# Altium schematic sheet 原理图.SchDoc
size A4
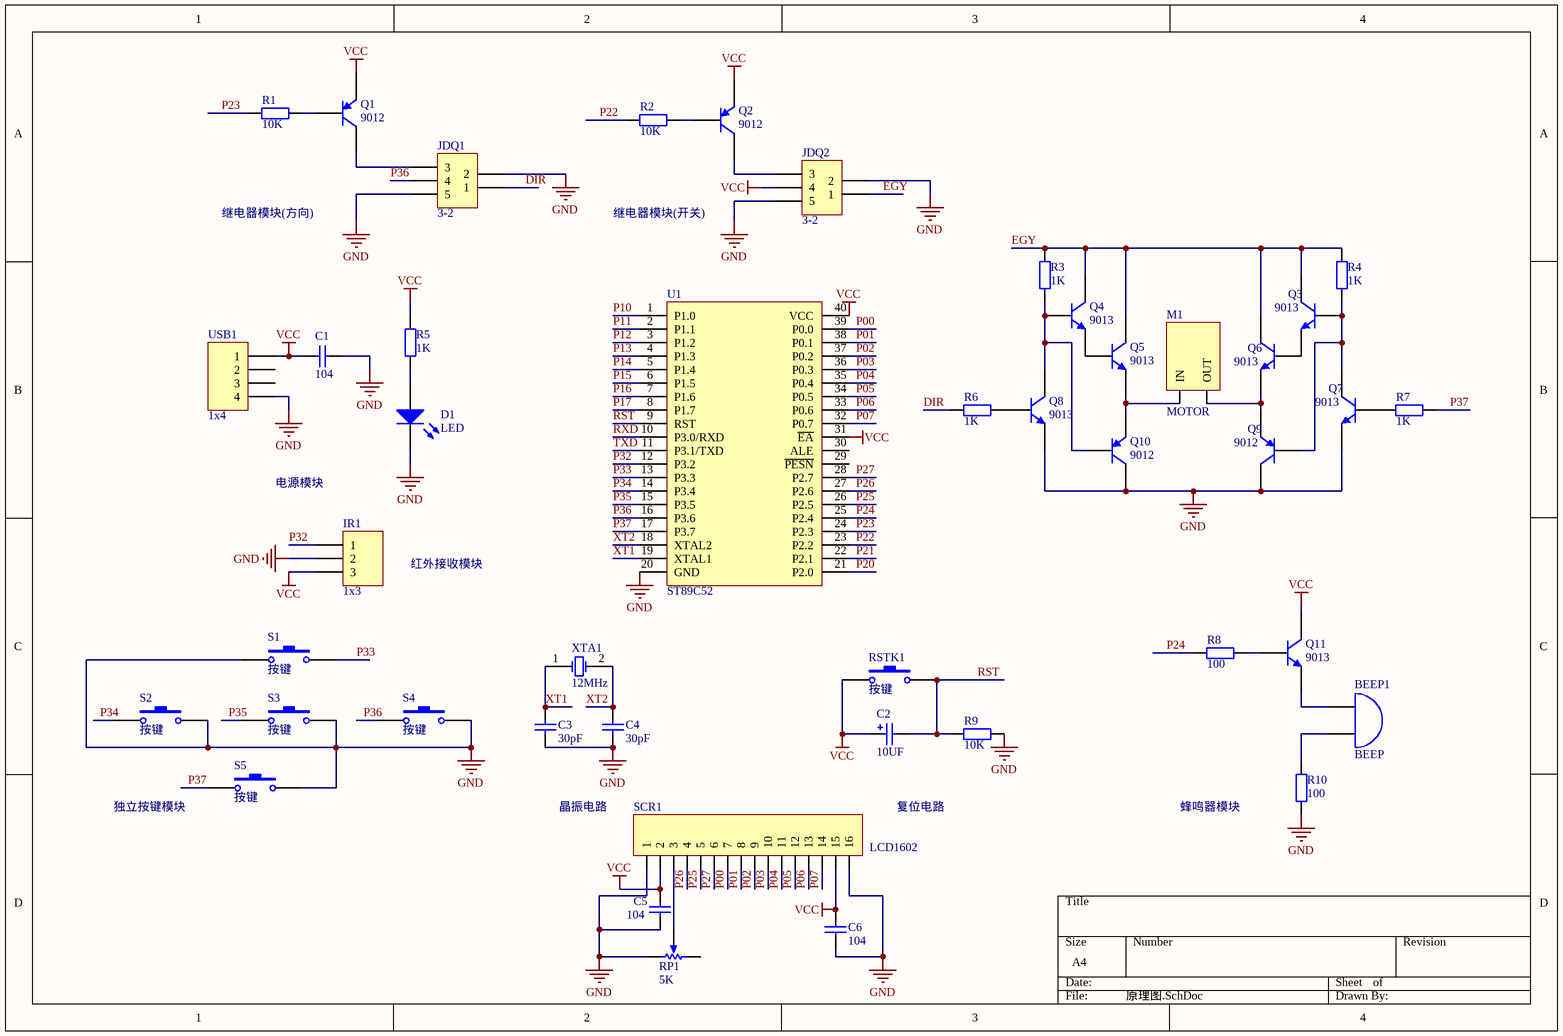
[diagram p0: 原理图.SchDoc]

## Parts
BEEP1  BEEP  [BEEP]
C1  104  [CAP]
C2  10UF  [CAP-ELEC]
C3  30pF  [CAP]
C4  30pF  [CAP]
C5  104  [CAP]
C6  104  [CAP]
D1  LED  [LED]
IR1  1x3  [RAY]
JDQ1  3-2  [RELAY]
JDQ2  3-2  [RELAY]
M1  MOTOR  [MOTOR]
Q1  9012  [PINS-3]
Q2  9012  [PINS-3]
Q3  9013  [PINS-3]
Q4  9013  [PINS-3]
Q5  9013  [PINS-3]
Q6  9013  [PINS-3]
Q7  9013  [PINS-3]
Q8  9013  [PINS-3]
Q9  9012  [PINS-3]
Q10  9012  [PINS-3]
Q11  9013  [PINS-3]
R1  10K  [RES]
R2  10K  [RES]
R3  1K  [RES]
R4  1K  [RES]
R5  1K  [RES]
R6  1K  [RES]
R7  1K  [RES]
R8  100  [RES]
R9  10K  [RES]
R10  100  [RES]
RP1  5K  [RES-ADJ]
RSTK1  按键  [KEY-4]
S1  按键  [KEY-4]
S2  按键  [KEY-4]
S3  按键  [KEY-4]
S4  按键  [KEY-4]
S5  按键  [KEY-4]
SCR1  LCD1602  [LCD]
U1  ST89C52  [STC89C52]
USB1  1x4  [USB]
XTA1  12MHz  [CRYSTAL]

## Nets
GND: C1.1 C3.1 C4.1 C5.1 C6.1 D1.2(K) IR1.2 JDQ1.?2(2) JDQ1.?3(5) JDQ2.?2(2) JDQ2.?3(5) Q7.3(E) Q8.3(E) Q9.3(C) Q10.3(C) R9.1 R10.2 RP1.3(BOT) S1.1 S2.2 S3.2 S4.2 S5.2 SCR1.?1(1) SCR1.?16(16) U1.20(GND) USB1.4
VCC: C1.2 C2.1 C5.2 C6.2 IR1.3 JDQ2.?4(4) Q1.1(E) Q2.1(E) Q11.1(C) R5.1 RSTK1.1 SCR1.?2(2) SCR1.?15(15) U1.31(~{EA}) U1.40(VCC) USB1.1
DIR: JDQ1.?1(1) R6.1
EGY: JDQ2.?1(1) Q3.1(C) Q4.1(C) Q5.1(C) Q6.1(C) R3.1 R4.1
P00: SCR1.?7(7) U1.39(P0.0)
P01: SCR1.?8(8) U1.38(P0.1)
P02: SCR1.?9(9) U1.37(P0.2)
P03: SCR1.?10(10) U1.36(P0.3)
P04: SCR1.?11(11) U1.35(P0.4)
P05: SCR1.?12(12) U1.34(P0.5)
P06: SCR1.?13(13) U1.33(P0.6)
P07: SCR1.?14(14) U1.32(P0.7)
P10: U1.1(P1.0)
P11: U1.2(P1.1)
P12: U1.3(P1.2)
P13: U1.4(P1.3)
P14: U1.5(P1.4)
P15: U1.6(P1.5)
P16: U1.7(P1.6)
P17: U1.8(P1.7)
P20: U1.21(P2.0)
P21: U1.22(P2.1)
P22: R2.1 U1.23(P2.2)
P23: R1.1 U1.24(P2.3)
P24: R8.1 U1.25(P2.4)
P25: SCR1.?5(5) U1.26(P2.5)
P26: SCR1.?4(4) U1.27(P2.6)
P27: SCR1.?6(6) U1.28(P2.7)
P32: IR1.1 U1.12(P3.2)
P33: S1.2 U1.13(P3.3)
P34: S2.1 U1.14(P3.4)
P35: S3.1 U1.15(P3.5)
P36: JDQ1.?4(4) S4.1 U1.16(P3.6)
P37: R7.1 S5.1 U1.17(P3.7)
RST: C2.2 R9.2 RSTK1.2 U1.9(RST)
RXD: U1.10(P3.0/RXD)
TXD: U1.11(P3.1/TXD)
XT1: C3.2 U1.19(XTAL1) XTA1.1(OSC1)
XT2: C4.2 U1.18(XTAL2) XTA1.2(OSC2)
NetBEEP1_1: BEEP1.1(A) Q11.3(E)
NetBEEP1_2: BEEP1.2(B) R10.1
NetD1_1: D1.1(A) R5.2
NetJDQ1_?5: JDQ1.?5(3) Q1.3(C)
NetJDQ2_?5: JDQ2.?5(3) Q2.3(C)
NetM1_?1: M1.?1(OUT) Q6.3(E) Q9.1(E)
NetM1_?2: M1.?2(IN) Q5.3(E) Q10.1(E)
NetQ1_2: Q1.2(B) R1.2
NetQ2_2: Q2.2(B) R2.2
NetQ3_2: Q3.2(B) Q7.1(C) Q9.2(B) R4.2
NetQ3_3: Q3.3(E) Q6.2(B)
NetQ4_2: Q4.2(B) Q8.1(C) Q10.2(B) R3.2
NetQ4_3: Q4.3(E) Q5.2(B)
NetQ7_2: Q7.2(B) R7.2
NetQ8_2: Q8.2(B) R6.2
NetQ11_2: Q11.2(B) R8.2
NetRP1_2: RP1.2(TAP) SCR1.?3(3)

Not connected (* = marked no-connect by the designer): RP1 1(TOP); U1 29(~{PESN}) 30(ALE); USB1 2 3

## Notes on the sheet
- 继电器模块(方向)
- 继电器模块(开关)
- 电源模块
- 红外接收模块
- 独立按键模块
- 晶振电路
- 复位电路
- 蜂鸣器模块

## Library data of the parts
BEEP1 = 蜂鸣器
C1 C3-C6 = 瓷片电容
C2 = 电解电容
JDQ1 JDQ2 = RELAY
Q1 Q2 Q9 Q10 = PNP
Q3-Q8 Q11 = NPN
R1-R10 = 电阻
RP1 = 可调电阻
SCR1 = LCD
U1 = STC89C52
XTA1 = 晶振